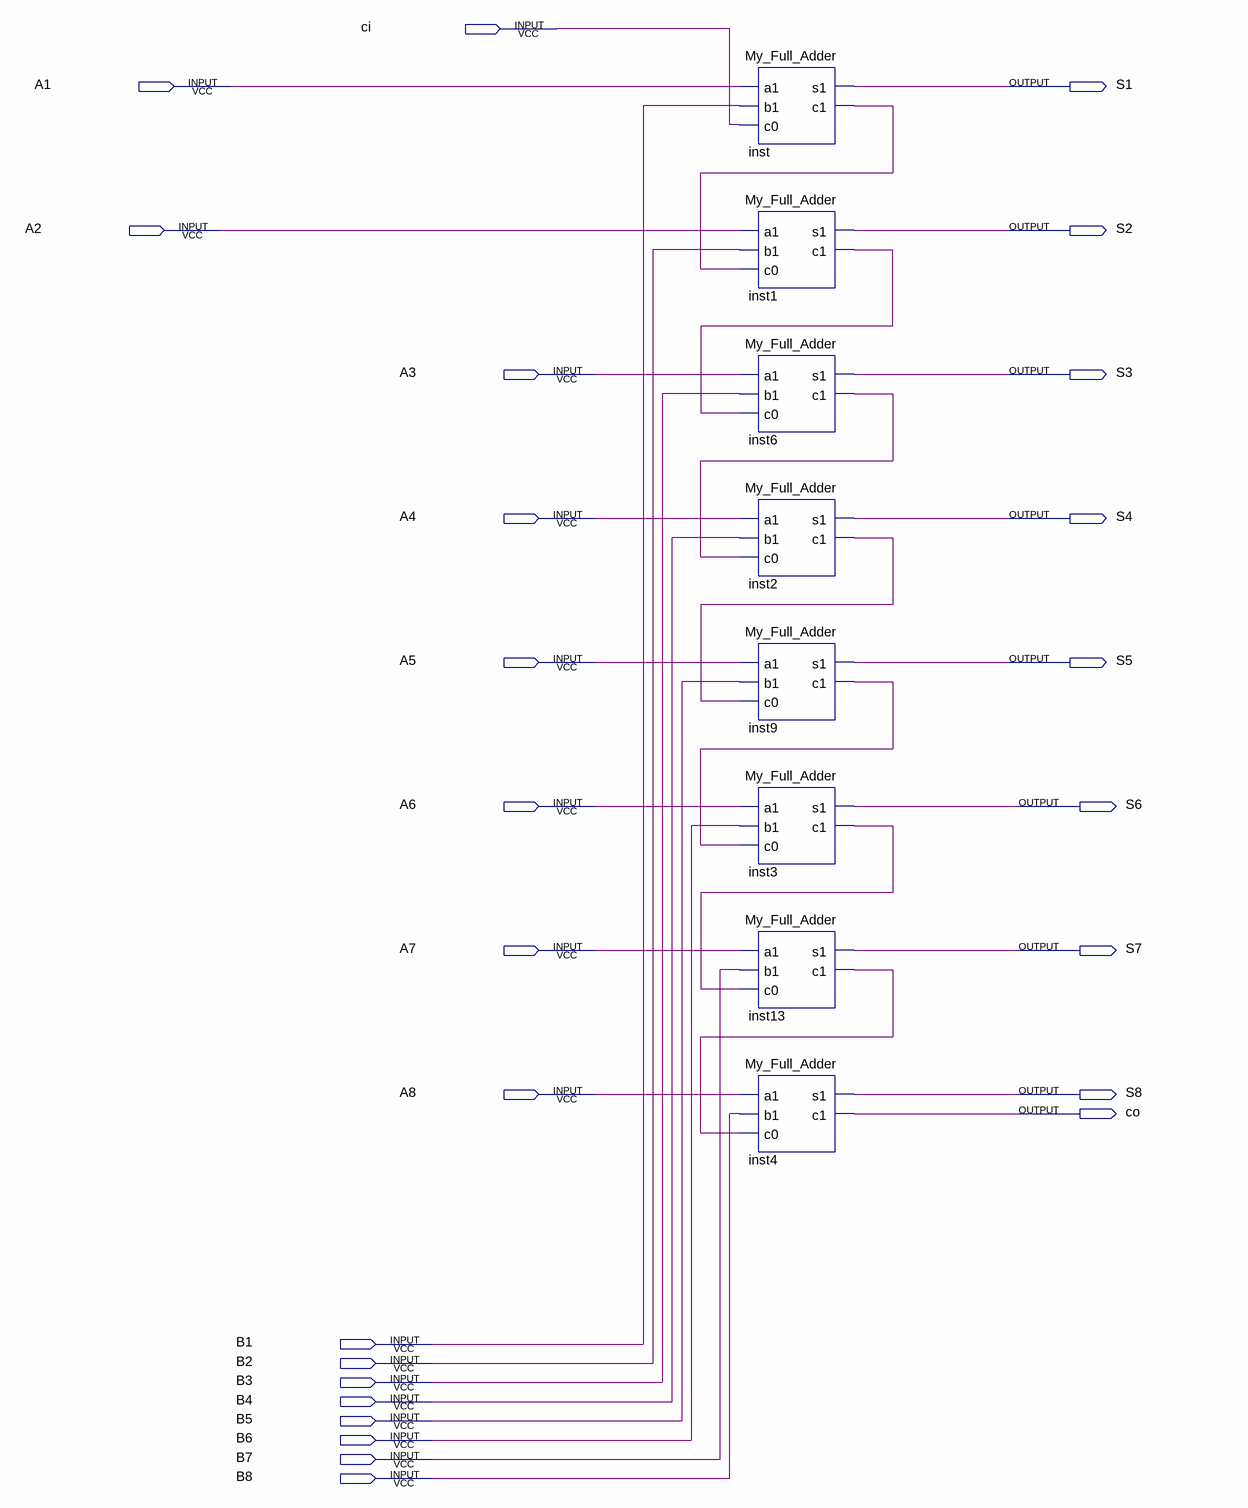
[diagram p0: schematic sheet]
// Quartus schematic Add_8.bdf as structural Verilog: 8 symbols, 26 pins
module Add_8 (
  input  ci,
  input  A1,
  input  A2,
  input  A3,
  input  A4,
  input  A5,
  input  A6,
  input  A7,
  input  A8,
  input  B1,
  input  B2,
  input  B3,
  input  B4,
  input  B5,
  input  B6,
  input  B7,
  input  B8,
  output S1,
  output S2,
  output S3,
  output S4,
  output S5,
  output S6,
  output S7,
  output S8,
  output co
);

  wire inst1_c1, inst2_c1, inst3_c1, inst6_c1, inst9_c1, inst13_c1, inst_c1;

  My_Full_Adder inst (.a1(A1), .b1(B1), .c0(ci), .s1(S1), .c1(inst_c1));
  My_Full_Adder inst1 (.a1(A2), .b1(B2), .c0(inst_c1), .s1(S2), .c1(inst1_c1));
  My_Full_Adder inst6 (.a1(A3), .b1(B3), .c0(inst1_c1), .s1(S3), .c1(inst6_c1));
  My_Full_Adder inst2 (.a1(A4), .b1(B4), .c0(inst6_c1), .s1(S4), .c1(inst2_c1));
  My_Full_Adder inst9 (.a1(A5), .b1(B5), .c0(inst2_c1), .s1(S5), .c1(inst9_c1));
  My_Full_Adder inst3 (.a1(A6), .b1(B6), .c0(inst9_c1), .s1(S6), .c1(inst3_c1));
  My_Full_Adder inst13 (.a1(A7), .b1(B7), .c0(inst3_c1), .s1(S7), .c1(inst13_c1));
  My_Full_Adder inst4 (.a1(A8), .b1(B8), .c0(inst13_c1), .s1(S8), .c1(co));
endmodule
